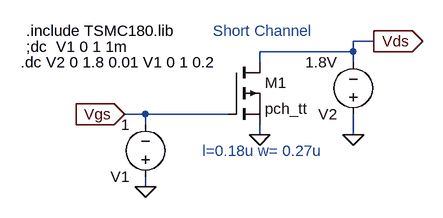
[diagram p0: schematic Prob_4b3.asc]
Prob_4b3.asc, the LTspice schematic file:
Version 4
SHEET 1 880 680
WIRE 416 80 384 80
WIRE 384 96 384 80
WIRE 384 96 240 96
WIRE 240 112 240 96
WIRE 384 112 384 96
WIRE 64 192 32 192
WIRE 192 192 64 192
WIRE 64 208 64 192
WIRE 240 224 240 208
WIRE 384 224 384 192
WIRE 64 304 64 288
FLAG 64 304 0
FLAG 240 224 0
FLAG 384 224 0
FLAG 32 192 Vgs
IOPIN 32 192 In
FLAG 416 80 Vds
IOPIN 416 80 Out
SYMBOL voltage 64 304 R180
WINDOW 123 0 0 Left 0
WINDOW 39 0 0 Left 0
SYMATTR InstName V1
SYMATTR Value 1
SYMBOL voltage 384 208 R180
WINDOW 123 0 0 Left 0
WINDOW 39 0 0 Left 0
SYMATTR InstName V2
SYMATTR Value 1.8V
SYMBOL pmos 192 112 R0
SYMATTR InstName M1
SYMATTR Value pch_tt
SYMATTR Value2 l=0.18u w= 0.27u
TEXT -120 64 Left 2 !.include TSMC180.lib
TEXT -128 112 Left 2 !.dc V2 0 1.8 0.01 V1 0 1 0.2
TEXT -120 88 Left 2 !;dc  V1 0 1 1m
TEXT 168 64 Left 2 ;Short Channel
TEXT 152 248 Left 2 ;l=0.18u w= 0.27u

The netlist it stands for:
* Prob_4b3.asc
V1 0 Vgs 1
V2 0 Vds 1.8V
M1 Vds Vgs 0 0 pch_tt l=0.18u w= 0.27u
.model NMOS NMOS
.model PMOS PMOS
.lib standard.mos
.include TSMC180.lib
.dc V2 0 1.8 0.01 V1 0 1 0.2
;dc  V1 0 1 1m
* Short Channel
* l=0.18u w= 0.27u
.backanno
.end